# Altium project BeagleCape.PrjPcb
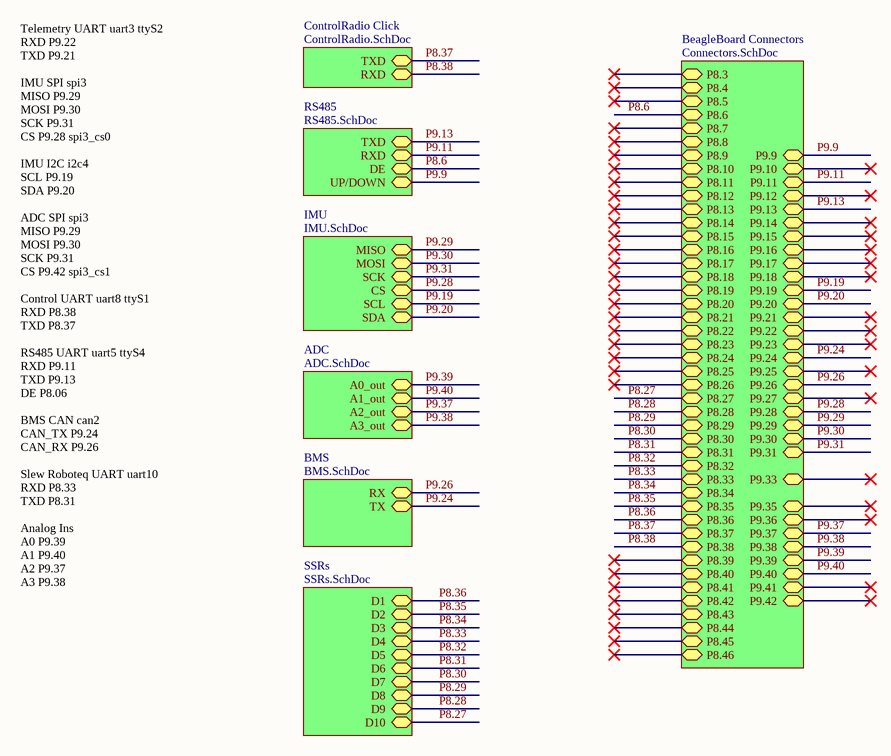
[diagram p0: Main.SchDoc]
9 sheets, 235 parts. Net scope: hierarchical (ports join the sheet entries above them; power ports are global).
Board file: Main.PcbDoc
Sheets:
  Main.SchDoc
    RS485 = RS485.SchDoc
    IMU = IMU.SchDoc
    ADC = ADC.SchDoc
    BeagleBoard Connectors = Connectors.SchDoc
    ControlRadio Click = ControlRadio.SchDoc
    BMS = BMS.SchDoc
    SSRs = SSRs.SchDoc
      FET10 = FET.SchDoc
      FET9 = FET.SchDoc
      FET8 = FET.SchDoc
      FET7 = FET.SchDoc
      FET6 = FET.SchDoc
      FET5 = FET.SchDoc
      FET4 = FET.SchDoc
      FET3 = FET.SchDoc
      FET2 = FET.SchDoc
      FET1 = FET.SchDoc

## Sheet Main.SchDoc
size A

### Sub-sheets
ADC = ADC.SchDoc: A2_out, A3_out, A0_out, A1_out
BeagleBoard Connectors = Connectors.SchDoc: P9.42, P9.17, P8.18, P9.21, P8.32, P9.33, P9.23, P8.28, P9.19, P9.16, P9.12, P9.31, P8.26, P9.15, P8.41, P9.36, P8.46, P8.36, P9.14, P8.12, P9.13, P9.20, P9.11, P8.20, P9.40, P8.24, P9.28, P9.30, P9.24, P9.22, P9.18, P8.22, P8.16, P8.44, P9.38, P8.38, P8.34, P9.26, P8.43, P9.25, P8.42, P9.41, P9.35, P9.27, P9.37, P9.39, P8.10, P8.30, P8.14, P8.45, P8.6, P9.29, P9.10, P8.4, P9.9, P8.8, P8.40, P8.5, P8.27, P8.3, P8.21, P8.7, P8.39, P8.19, P8.17, P8.15, P8.13, P8.35, P8.33, P8.37, P8.23, P8.9, P8.11, P8.25, P8.31, P8.29
BMS = BMS.SchDoc: RX, TX
ControlRadio Click = ControlRadio.SchDoc: TXD, RXD
IMU = IMU.SchDoc: MISO, MOSI, SCK, CS, SCL, SDA
RS485 = RS485.SchDoc: TXD, RXD, DE, UP/DOWN
SSRs = SSRs.SchDoc: D1, D2, D3, D4, D5, D6, D7, D8, D9, D10

### Nets
P8.6: sheet RS485/DE, sheet BeagleBoard Connectors/P8.6
P8.27: sheet BeagleBoard Connectors/P8.27, sheet SSRs/D10
P8.28: sheet BeagleBoard Connectors/P8.28, sheet SSRs/D9
P8.29: sheet BeagleBoard Connectors/P8.29, sheet SSRs/D8
P8.30: sheet BeagleBoard Connectors/P8.30, sheet SSRs/D7
P8.31: sheet BeagleBoard Connectors/P8.31, sheet SSRs/D6
P8.32: sheet BeagleBoard Connectors/P8.32, sheet SSRs/D5
P8.33: sheet BeagleBoard Connectors/P8.33, sheet SSRs/D4
P8.34: sheet BeagleBoard Connectors/P8.34, sheet SSRs/D3
P8.35: sheet BeagleBoard Connectors/P8.35, sheet SSRs/D2
P8.36: sheet BeagleBoard Connectors/P8.36, sheet SSRs/D1
P8.37: sheet BeagleBoard Connectors/P8.37, sheet ControlRadio Click/TXD
P8.38: sheet BeagleBoard Connectors/P8.38, sheet ControlRadio Click/RXD
P9.9: sheet RS485/UP/DOWN, sheet BeagleBoard Connectors/P9.9
P9.11: sheet RS485/RXD, sheet BeagleBoard Connectors/P9.11
P9.13: sheet RS485/TXD, sheet BeagleBoard Connectors/P9.13
P9.19: sheet IMU/SCL, sheet BeagleBoard Connectors/P9.19
P9.20: sheet IMU/SDA, sheet BeagleBoard Connectors/P9.20
P9.24: sheet BeagleBoard Connectors/P9.24, sheet BMS/TX
P9.26: sheet BeagleBoard Connectors/P9.26, sheet BMS/RX
P9.28: sheet IMU/CS, sheet BeagleBoard Connectors/P9.28
P9.29: sheet IMU/MISO, sheet BeagleBoard Connectors/P9.29
P9.30: sheet IMU/MOSI, sheet BeagleBoard Connectors/P9.30
P9.31: sheet IMU/SCK, sheet BeagleBoard Connectors/P9.31
P9.37: sheet ADC/A2_out, sheet BeagleBoard Connectors/P9.37  [project net A2_18]
P9.38: sheet ADC/A3_out, sheet BeagleBoard Connectors/P9.38  [project net A3_18]
P9.39: sheet ADC/A0_out, sheet BeagleBoard Connectors/P9.39  [project net A0_18]
P9.40: sheet ADC/A1_out, sheet BeagleBoard Connectors/P9.40  [project net A1_18]

### Notes on the sheet
- Telemetry UART uart3 ttyS2
  RXD P9.22
  TXD P9.21
  IMU SPI spi3
  MISO P9.29
  MOSI P9.30
  SCK P9.31
  CS P9.28 spi3_cs0
  IMU I2C i2c4
  SCL P9.19
  SDA P9.20
  ADC SPI spi3
  MISO P9.29
  MOSI P9.30
  SCK P9.31
  CS P9.42 spi3_cs1
  Control UART uart8 ttyS1
  RXD P8.38
  TXD P8.37
  RS485 UART uart5 ttyS4
  RXD P9.11
  TXD P9.13
  DE P8.06
  BMS CAN can2
  CAN_TX P9.24
  CAN_RX P9.26
  Slew Roboteq UART uart10
  RXD P8.33
  TXD P8.31
  Analog Ins
  A0 P9.39
  A1 P9.40
  A2 P9.37
  A3 P9.38

## Sheet RS485.SchDoc
size A
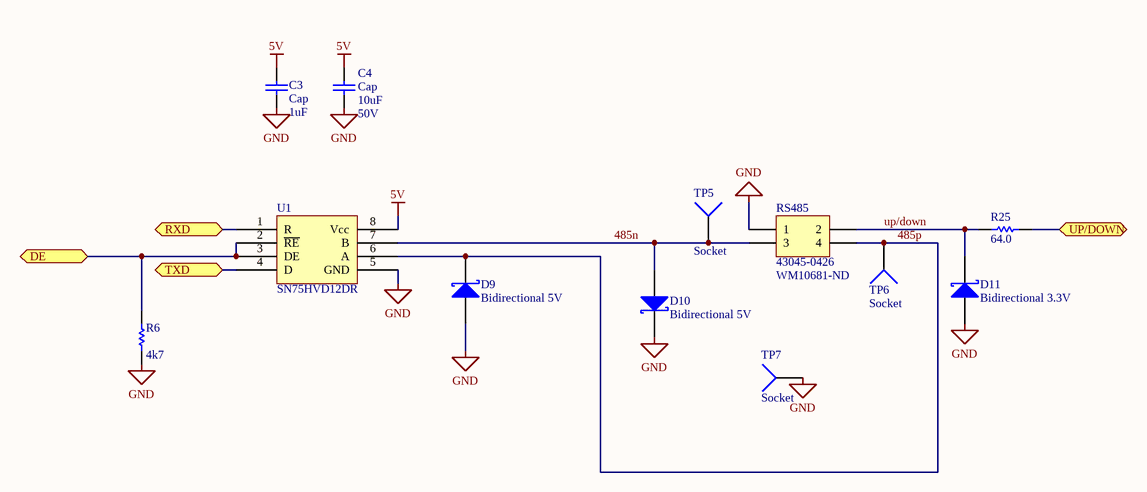
[diagram p1: RS485.SchDoc]

### Parts
C3  Cap  value 1uF  [RESC3116X65N]
C4  Cap  value 10uF  Voltage Rating: 50V  [CAPC3216X180N]
D9  Bidirectional 5V  [THRMC0603X33N]
D10  Bidirectional 5V  [THRMC0603X33N]
D11  Bidirectional 3.3V  [THRMC0603X33N]
R6  value 4k7  [0402]  (hidden comment: Res1)
R25  value 64.0  [0402]  (hidden comment: Res1)
RS485  43045-0426  Vendor Part Number: WM10681-ND  [43045-0426]
TP5  Socket  [5006]
TP6  Socket  [5006]
TP7  Socket  [5006]
U1  SN75HVD12DR  [SOIC127P599X175-8N]

### Ports
DE, RXD, TXD, UP/DOWN

### Nets
5V: C3.2 C4.2 U1.8(Vcc)
GND: C3.1 C4.1 D9.3(A) D10.1(K) D11.3(A) R6.2 RS485.1 TP7.1 U1.5(GND)
485n: D10.3(A) RS485.3 TP5.1 U1.7(B)
485p: D9.1(K) RS485.4 TP6.1 U1.6(A)
P8.6: R6.1 U1.2(~{RE}) U1.3(DE) ; port DE
P9.9: R25.1 ; port UP/DOWN
P9.11: U1.1(R) ; port RXD
P9.13: U1.4(D) ; port TXD
up/down: D11.1(K) R25.2 RS485.2

### Library data of the parts
C3 = Cap: Capacitor; Manufacturer Part Number: CL31B105KCHNNNE; Vendor Part Number: 1276-1838-1-ND
C4 = Cap: Capacitor; Manufacturer Part Number: CL31A106MBHNNNE; Vendor Part Number: 1276-6736-1-ND
D9 D10 = Diode 10TQ040: TVS; Manufacturer Part Number: CPDUC5V0R-HF; Vendor Part Number: 641-1764-1-ND
D11 = Diode 10TQ040: TVS; Manufacturer Part Number: SP1103C-01UTG; Vendor Part Number: F10154CT-ND
R6 = Res1: Resistor; Manufacturer Part Number: RC0402FR-074K7L; Vendor Part Number: 311-4.7KLRCT-ND; Tolerance: 1%
R25 = Res1: Resistor; Manufacturer Part Number: RC0402FR-0760R4L; Vendor Part Number: 311-60.4LRCT-ND; Tolerance: 1%; DNP: *
RS485 = Header 2X2: Header, 2-Pin, Dual row; LatestRevisionDate: 17-Jul-2002; LatestRevisionNote: Re-released for DXP Platform.; Publisher: Altium Limited
TP5-TP7 = Socket: Vendor Part Number: 36-5006-ND; LatestRevisionDate: 17-Jul-2002; LatestRevisionNote: Re-released for DXP Platform.; Publisher: Altium Limited; Manufacturer Part Number: 5006
U1 = SN75HVD12DR: Manufacturer Part Number: THVD1450DR; Vendor Part Number: 296-50395-1-ND; Vendor: Digikey

## Sheet IMU.SchDoc
size A
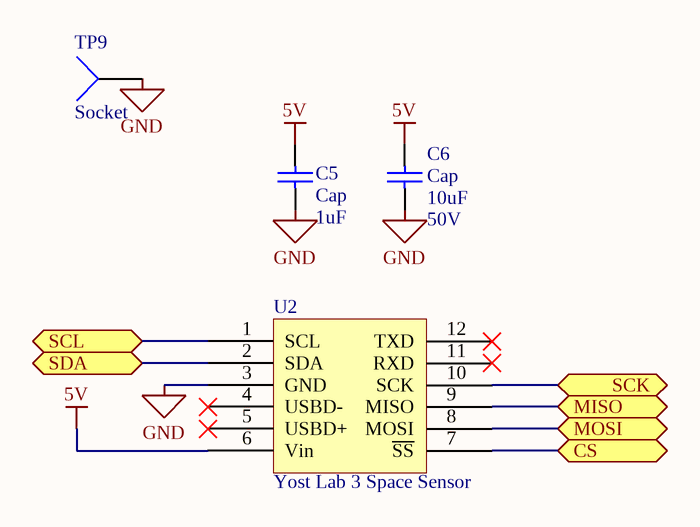
[diagram p2: IMU.SchDoc]

### Parts
C5  Cap  value 1uF  [RESC3116X65N]
C6  Cap  value 10uF  Voltage Rating: 50V  [CAPC3216X180N]
TP9  Socket  [5006]
U2  Yost Lab 3 Space Sensor  [Yost 3 Space Sensor]

### Ports
CS, MISO, MOSI, SCK, SCL, SDA

### Nets
5V: C5.2 C6.2 U2.6(Vin)
GND: C5.1 C6.1 TP9.1 U2.3(GND)
P9.19: U2.1(SCL) ; port SCL
P9.20: U2.2(SDA) ; port SDA
P9.28: U2.7(~{SS}) ; port CS
P9.29: U2.9(MISO) ; port MISO
P9.30: U2.8(MOSI) ; port MOSI
P9.31: U2.10(SCK) ; port SCK

Not connected (* = marked no-connect by the designer): U2 4(USBD-)* 5(USBD+)* 11(RXD)* 12(TXD)*

### Library data of the parts
C5 = Cap: as C3 on sheet RS485
C6 = Cap: as C4 on sheet RS485
TP9 = Socket: Vendor Part Number: 36-5006-ND; LatestRevisionDate: 17-Jul-2002; LatestRevisionNote: Re-released for DXP Platform.; Publisher: Altium Limited; Manufacturer Part Number: 5006
U2 = Yost Lab 3 Space Sensor: Manufacturer Part Number: Yost Lab 3 Space Sensor; Vendor Part Number: Yost Lab 3 Space Sensor

## Sheet ADC.SchDoc
size A
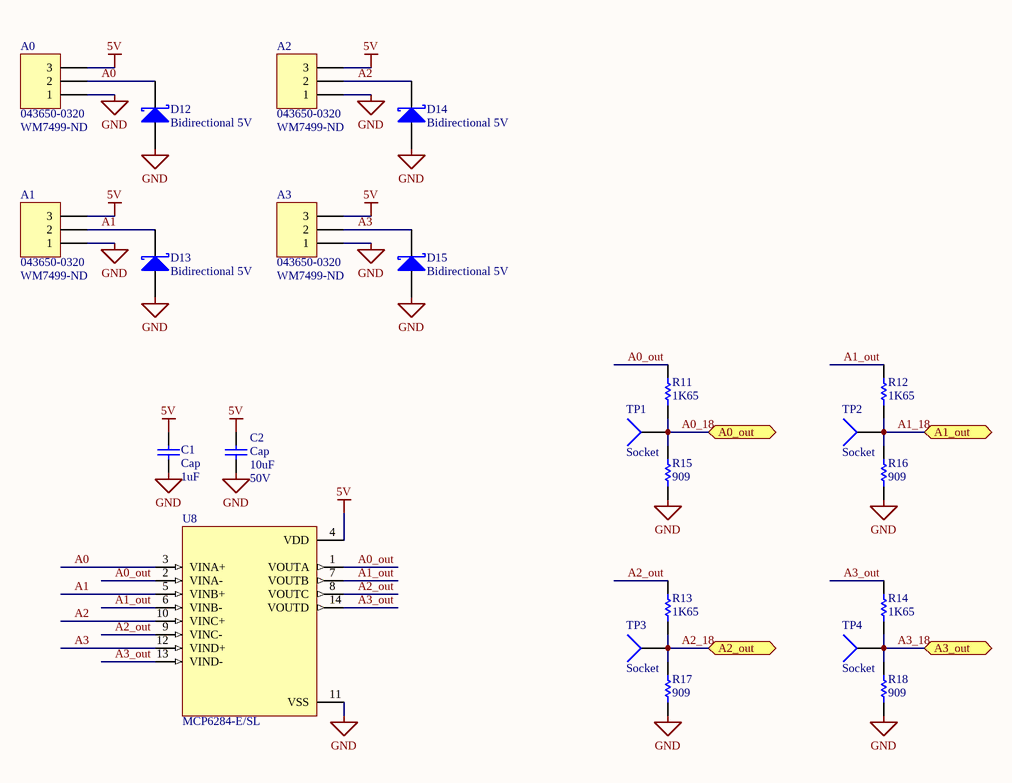
[diagram p3: ADC.SchDoc]

### Parts
A0  043650-0320  Vendor Part Number: WM7499-ND  [43650-0320]
A1  043650-0320  Vendor Part Number: WM7499-ND  [43650-0320]
A2  043650-0320  Vendor Part Number: WM7499-ND  [43650-0320]
A3  043650-0320  Vendor Part Number: WM7499-ND  [43650-0320]
C1  Cap  value 1uF  [RESC3116X65N]
C2  Cap  value 10uF  Voltage Rating: 50V  [CAPC3216X180N]
D12  Bidirectional 5V  [THRMC0603X33N]
D13  Bidirectional 5V  [THRMC0603X33N]
D14  Bidirectional 5V  [THRMC0603X33N]
D15  Bidirectional 5V  [THRMC0603X33N]
R11  value 1K65  [0402]  (hidden comment: Res1)
R12  value 1K65  [0402]  (hidden comment: Res1)
R13  value 1K65  [0402]  (hidden comment: Res1)
R14  value 1K65  [0402]  (hidden comment: Res1)
R15  value 909  [0402]  (hidden comment: Res1)
R16  value 909  [0402]  (hidden comment: Res1)
R17  value 909  [0402]  (hidden comment: Res1)
R18  value 909  [0402]  (hidden comment: Res1)
TP1  Socket  [5006]
TP2  Socket  [5006]
TP3  Socket  [5006]
TP4  Socket  [5006]
U8  MCP6284-E/SL  [SOIC127P600X175-14N]

### Ports
A0_out, A1_out, A2_out, A3_out

### Nets
5V: A0.3 A1.3 A2.3 A3.3 C1.2 C2.2 U8.4(VDD)
GND: A0.1 A1.1 A2.1 A3.1 C1.1 C2.1 D12.3(A) D13.3(A) D14.3(A) D15.3(A) R15.1 R16.1 R17.1 R18.1 U8.11(VSS)
A0: A0.2 D12.1(K) U8.3(VINA+)
A0_18: R11.1 R15.2 TP1.1 ; port A0_out
A0_out: R11.2 U8.1(VOUTA) U8.2(VINA-)
A1: A1.2 D13.1(K) U8.5(VINB+)
A1_18: R12.1 R16.2 TP2.1 ; port A1_out
A1_out: R12.2 U8.6(VINB-) U8.7(VOUTB)
A2: A2.2 D14.1(K) U8.10(VINC+)
A2_18: R13.1 R17.2 TP3.1 ; port A2_out
A2_out: R13.2 U8.8(VOUTC) U8.9(VINC-)
A3: A3.2 D15.1(K) U8.12(VIND+)
A3_18: R14.1 R18.2 TP4.1 ; port A3_out
A3_out: R14.2 U8.13(VIND-) U8.14(VOUTD)

### Library data of the parts
A0-A3 = Header 3: Header, 3-Pin; LatestRevisionDate: 17-Jul-2002; LatestRevisionNote: Re-released for DXP Platform.; Publisher: Altium Limited
C1 = Cap: as C3 on sheet RS485
C2 = Cap: as C4 on sheet RS485
D12-D15 = Diode 10TQ040: as D9 on sheet RS485
R11 = Res1: Resistor; Manufacturer Part Number: YAG3043CT-ND; Vendor Part Number: RC0402FR-071K65L; Tolerance: 1%
R12-R14 = Res1: Resistor; Manufacturer Part Number: RC0402FR-071K65L; Vendor Part Number: YAG3043CT-ND; Tolerance: 1%
R15-R18 = Res1: Resistor; Manufacturer Part Number: RC0402FR-071K8L; Vendor Part Number: YAG3256CT-ND; Tolerance: 1%
TP1-TP4 = Socket: Vendor Part Number: 36-5006-ND; LatestRevisionDate: 17-Jul-2002; LatestRevisionNote: Re-released for DXP Platform.; Publisher: Altium Limited; Manufacturer Part Number: 5006
U8 = MCP6284-E/SL: General Purpose Amplifier 4 Circuit Rail-to-Rail 14-SOIC; Vendor Part Number: MCP6284-E/SL-ND; MF: Microchip; Value: *; SnapEDA_Link: https://www.snapeda.com/parts/MCP6284-E/SL/Microchip/view-part/282490/?ref=snap; MP: MCP6284-E/SL; Availability: Warning; Mouser-Purchase-URL: https://snapeda.com/shop?store=Mouser&id=282490; Price: None; DigiKey-Purchase-URL: https://snapeda.com/shop?store=DigiKey&id=282490; Package: SOIC-14 Microchip; Manufacturer Part Number: MCP6284-E/SL

## Sheet Connectors.SchDoc
size A
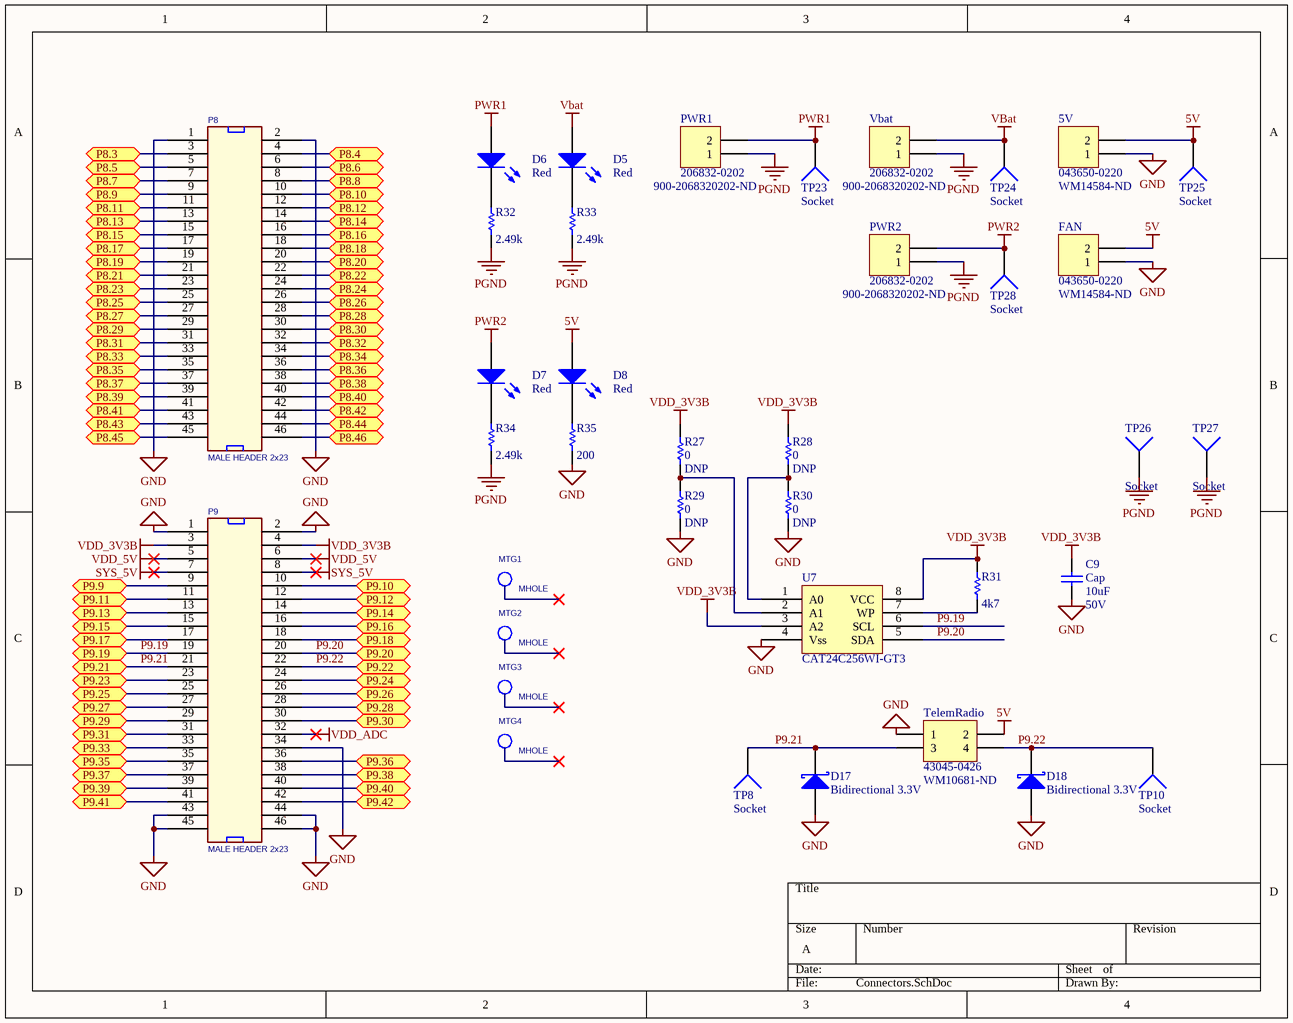
[diagram p4: Connectors.SchDoc]

### Parts
5V  043650-0220  Vendor Part Number: WM14584-ND  [43650-0220]
C9  Cap  value 10uF  Voltage Rating: 50V  [CAPC3216X180N]
D5  Color: Red  [THRMC0603X33N]  (hidden comment: LED0)
D6  Color: Red  [THRMC0603X33N]  (hidden comment: LED0)
D7  Color: Red  [THRMC0603X33N]  (hidden comment: LED0)
D8  Color: Red  [THRMC0603X33N]  (hidden comment: LED0)
D17  Bidirectional 3.3V  [THRMC0603X33N]
D18  Bidirectional 3.3V  [THRMC0603X33N]
FAN  043650-0220  Vendor Part Number: WM14584-ND  [43650-0220]
MTG1  MHOLE  [MTGH200C125D_PL]  (no BOM)
MTG2  MHOLE  [MTGH200C125D_PL]  (no BOM)
MTG3  MHOLE  [MTGH200C125D_PL]  (no BOM)
MTG4  MHOLE  [MTGH200C125D_PL]  (no BOM)
P8  MALE HEADER 2x23  [95278-101B46LF]
P9  MALE HEADER 2x23  [95278-101B46LF]
PWR1  206832-0202  Vendor Part Number: 900-2068320202-ND  [206832-0202]
PWR2  206832-0202  Vendor Part Number: 900-2068320202-ND  [206832-0202]
R27  value 0  [0402]  (hidden comment: Res1)
R28  value 0  [0402]  (hidden comment: Res1)
R29  value 0  [0402]  (hidden comment: Res1)
R30  value 0  [0402]  (hidden comment: Res1)
R31  value 4k7  [0402]  (hidden comment: Res1)
R32  value 2.49k  [0402]  (hidden comment: Res1)
R33  value 2.49k  [0402]  (hidden comment: Res1)
R34  value 2.49k  [0402]  (hidden comment: Res1)
R35  value 200  [0402]  (hidden comment: Res1)
TelemRadio  43045-0426  Vendor Part Number: WM10681-ND  [43045-0426]
TP8  Socket  [5006]
TP10  Socket  [5006]
TP23  Socket  [5006]
TP24  Socket  [5006]
TP25  Socket  [5006]
TP26  Socket  [5006]
TP27  Socket  [5006]
TP28  Socket  [5006]
U7  CAT24C256WI-GT3  [SOIC127P599X175-8N]
Vbat  206832-0202  Vendor Part Number: 900-2068320202-ND  [206832-0202]

### Ports
P8.3, P8.4, P8.5, P8.6, P8.7, P8.8, P8.9, P8.10, P8.11, P8.12, P8.13, P8.14, P8.15, P8.16, P8.17, P8.18, P8.19, P8.20, P8.21, P8.22, P8.23, P8.24, P8.25, P8.26, P8.27, P8.28, P8.29, P8.30, P8.31, P8.32, P8.33, P8.34, P8.35, P8.36, P8.37, P8.38, P8.39, P8.40, P8.41, P8.42, P8.43, P8.44, P8.45, P8.46, P9.9, P9.10, P9.11, P9.12, P9.13, P9.14, P9.15, P9.16, P9.17, P9.18, P9.19, P9.20, P9.21, P9.22, P9.23, P9.24, P9.25, P9.26, P9.27, P9.28, P9.29, P9.30, P9.31, P9.33, P9.35, P9.36, P9.37, P9.38, P9.39, P9.40, P9.41, P9.42

### Nets
5V: 5V.2 D8.1(A) FAN.2 TelemRadio.2 TP25.1
GND: 5V.1 C9.1 D17.3(A) D18.3(A) FAN.1 P8.1 P8.2 P9.1 P9.2 P9.34 P9.43 P9.44 P9.45 P9.46 R29.1 R30.1 R35.2 TelemRadio.1 U7.4(Vss)
PGND: PWR1.1 PWR2.1 R32.2 R33.2 R34.2 TP26.1 TP27.1 Vbat.1
PWR1: D6.1(A) PWR1.2 TP23.1
PWR2: D7.1(A) PWR2.2 TP28.1
SYS_5V: P9.7 P9.8
VBat: D5.1(A) TP24.1 Vbat.2
VDD_3V3B: C9.2 P9.3 P9.4 R27.2 R28.2 R31.1 U7.3(A2) U7.8(VCC)
VDD_5V: P9.5 P9.6
VDD_ADC: P9.32
A0_18: P9.39 ; port P9.39
A1_18: P9.40 ; port P9.40
A2_18: P9.37 ; port P9.37
A3_18: P9.38 ; port P9.38
P8.6: P8.6 ; port P8.6
P8.27: P8.27 ; port P8.27
P8.28: P8.28 ; port P8.28
P8.29: P8.29 ; port P8.29
P8.30: P8.30 ; port P8.30
P8.31: P8.31 ; port P8.31
P8.32: P8.32 ; port P8.32
P8.33: P8.33 ; port P8.33
P8.34: P8.34 ; port P8.34
P8.35: P8.35 ; port P8.35
P8.36: P8.36 ; port P8.36
P8.37: P8.37 ; port P8.37
P8.38: P8.38 ; port P8.38
P9.9: P9.9 ; port P9.9
P9.11: P9.11 ; port P9.11
P9.13: P9.13 ; port P9.13
P9.19: P9.19 U7.6(SCL) ; port P9.19
P9.20: P9.20 U7.5(SDA) ; port P9.20
P9.21: D17.1(K) P9.21 TelemRadio.3 TP8.1 ; port P9.21
P9.22: D18.1(K) P9.22 TelemRadio.4 TP10.1 ; port P9.22
P9.24: P9.24 ; port P9.24
P9.26: P9.26 ; port P9.26
P9.28: P9.28 ; port P9.28
P9.29: P9.29 ; port P9.29
P9.30: P9.30 ; port P9.30
P9.31: P9.31 ; port P9.31
NetD5_3: D5.3(K) R33.1
NetD6_3: D6.3(K) R32.1
NetD7_3: D7.3(K) R34.1
NetD8_3: D8.3(K) R35.1
NetP8_3: P8.3 ; port P8.3
NetP8_4: P8.4 ; port P8.4
NetP8_5: P8.5 ; port P8.5
NetP8_7: P8.7 ; port P8.7
NetP8_8: P8.8 ; port P8.8
NetP8_9: P8.9 ; port P8.9
NetP8_10: P8.10 ; port P8.10
NetP8_11: P8.11 ; port P8.11
NetP8_12: P8.12 ; port P8.12
NetP8_13: P8.13 ; port P8.13
NetP8_14: P8.14 ; port P8.14
NetP8_15: P8.15 ; port P8.15
NetP8_16: P8.16 ; port P8.16
NetP8_17: P8.17 ; port P8.17
NetP8_18: P8.18 ; port P8.18
NetP8_19: P8.19 ; port P8.19
NetP8_20: P8.20 ; port P8.20
NetP8_21: P8.21 ; port P8.21
NetP8_22: P8.22 ; port P8.22
NetP8_23: P8.23 ; port P8.23
NetP8_24: P8.24 ; port P8.24
NetP8_25: P8.25 ; port P8.25
NetP8_26: P8.26 ; port P8.26
NetP8_39: P8.39 ; port P8.39
NetP8_40: P8.40 ; port P8.40
NetP8_41: P8.41 ; port P8.41
NetP8_42: P8.42 ; port P8.42
NetP8_43: P8.43 ; port P8.43
NetP8_44: P8.44 ; port P8.44
NetP8_45: P8.45 ; port P8.45
NetP8_46: P8.46 ; port P8.46
NetP9_10: P9.10 ; port P9.10
NetP9_12: P9.12 ; port P9.12
NetP9_14: P9.14 ; port P9.14
NetP9_15: P9.15 ; port P9.15
NetP9_16: P9.16 ; port P9.16
NetP9_17: P9.17 ; port P9.17
NetP9_18: P9.18 ; port P9.18
NetP9_23: P9.23 ; port P9.23
NetP9_25: P9.25 ; port P9.25
NetP9_27: P9.27 ; port P9.27
NetP9_33: P9.33 ; port P9.33
NetP9_35: P9.35 ; port P9.35
NetP9_36: P9.36 ; port P9.36
NetP9_41: P9.41 ; port P9.41
NetP9_42: P9.42 ; port P9.42
NetR27_1: R27.1 R29.2 U7.2(A1)
NetR28_1: R28.1 R30.2 U7.1(A0)
NetR31_2: R31.2 U7.7(WP)

Not connected (* = marked no-connect by the designer): MTG1 1(TP)*; MTG2 1(TP)*; MTG3 1(TP)*; MTG4 1(TP)*

### Library data of the parts
5V FAN PWR1 PWR2 Vbat = Header 2: Header, 2-Pin; LatestRevisionDate: 17-Jul-2002; LatestRevisionNote: Re-released for DXP Platform.; Publisher: Altium Limited
  PWR1 PWR2 Vbat: Manufacturer Part Number: 206832-0202
C9 = Cap: as C4 on sheet RS485
D5-D8 = LED0: Typical INFRARED GaAs LED; Vendor Part Number: 732-11991-1-ND; Manufacturer Part Number: 150040RS73240; Vf: 2V; I: 20mA
D17 D18 = Diode 10TQ040: as D11 on sheet RS485
P8 = HDR_46_F_2_0.1_0.1: CONN HEADER FMAL 46PS.1" DL GOLD; Manufacturer: Sullins Connector Solutions; Manufacturer Part Number: S7126-ND; Vendor Part Number: 95278-101-46LF; Vendor Part Number: 95278-101B46LF-ND; Number of Positions: 46; Number of Positions Loaded: All; Pitch: 0.100" (2.54mm); Supplier 1: Digi-Key; Supplier Part Number 1: S7126-ND; RoHS: RoHS Compliant; Category: Connectors, Interconnects; Stock 1: 750; Pricing 1: 1=2.75, 10=2.325, 25=2.2196, 50=2.0084, 100=1.7969, 250=1.58552, 500=1.4798, 1000=1.3741, 2500=1.32125 (USD); Connector Type: Header; Contact Type: Female Socket; Number of Rows: 2; Row Spacing: 0.100" (2.54mm); Mounting Type: Through Hole; Termination: Solder; Fastening Type: -; Features: -; Contact Finish: Gold; Contact Finish Thickness: Flash; Color: Black; Packaging: Bulk; ComponentLink1URL: http://www.sullinscorp.com/drawings/78_P(N)PxCxxxLFBN-RC,_10492-G.pdf; ComponentLink1Description: http://www.sullinscorp.com/drawings/78_P(N)PxCxxxLFBN-RC,_10492-G.pdf
P9 = HDR_46_F_2_0.1_0.1: CONN HEADER FMAL 46PS.1" DL GOLD; Manufacturer: Sullins Connector Solutions; Vendor Part Number: 95278-101-46LF; Vendor Part Number: 95278-101B46LF-ND; Number of Positions: 46; Number of Positions Loaded: All; Pitch: 0.100" (2.54mm); Supplier 1: Digi-Key; Supplier Part Number 1: S7126-ND; RoHS: RoHS Compliant; Category: Connectors, Interconnects; Stock 1: 750; Pricing 1: 1=2.75, 10=2.325, 25=2.2196, 50=2.0084, 100=1.7969, 250=1.58552, 500=1.4798, 1000=1.3741, 2500=1.32125 (USD); Connector Type: Header; Contact Type: Female Socket; Number of Rows: 2; Row Spacing: 0.100" (2.54mm); Mounting Type: Through Hole; Termination: Solder; Fastening Type: -; Features: -; Contact Finish: Gold; Contact Finish Thickness: Flash; Color: Black; Packaging: Bulk; ComponentLink1URL: http://www.sullinscorp.com/drawings/78_P(N)PxCxxxLFBN-RC,_10492-G.pdf; ComponentLink1Description: http://www.sullinscorp.com/drawings/78_P(N)PxCxxxLFBN-RC,_10492-G.pdf
R27-R30 = Res1: Resistor; Manufacturer Part Number: RC0402FR-070RL; Vendor Part Number: 311-0.0LRCT-ND; Tolerance: 1%; DNP: DNP
R31 = Res1: as R6 on sheet RS485
R32-R34 = Res1: Resistor; Manufacturer Part Number: RC0402FR-072K49L; Vendor Part Number: 311-2.49KLRCT-ND; Tolerance: 1%
R35 = Res1: Resistor; Manufacturer Part Number: RC0402FR-07200RL; Vendor Part Number: 311-200LRCT-ND; Tolerance: 1%
TelemRadio = Header 2X2: Header, 2-Pin, Dual row; LatestRevisionDate: 17-Jul-2002; LatestRevisionNote: Re-released for DXP Platform.; Publisher: Altium Limited
TP8 TP10 TP23-TP28 = Socket: Vendor Part Number: 36-5006-ND; LatestRevisionDate: 17-Jul-2002; LatestRevisionNote: Re-released for DXP Platform.; Publisher: Altium Limited; Manufacturer Part Number: 5006
U7 = CAT24C256WI-GT3: Vendor Part Number: CAT24C256WI-GT3OSCT-ND; Vendor: Digikey; Manufacturer Part Number: CAT24C256WI-GT3

## Sheet ControlRadio.SchDoc
size A
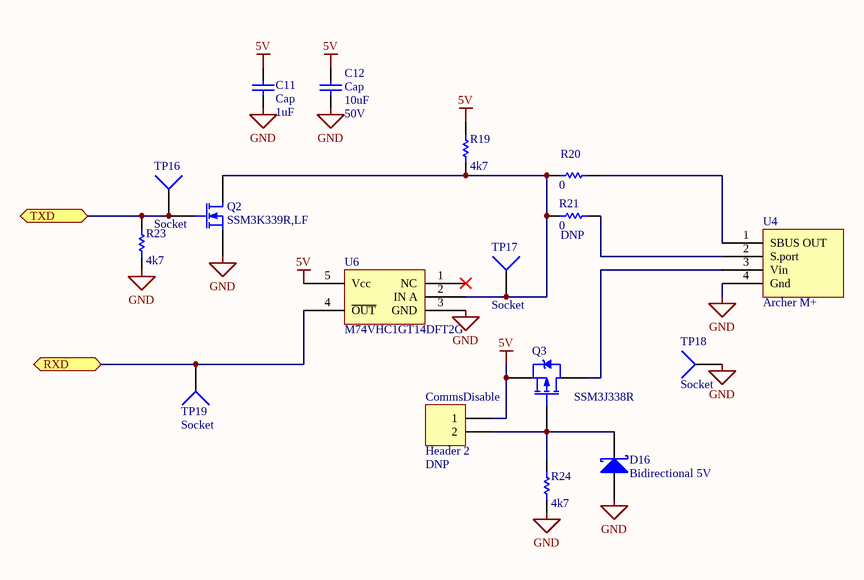
[diagram p5: ControlRadio.SchDoc]

### Parts
C11  Cap  value 1uF  [RESC3116X65N]
C12  Cap  value 10uF  Voltage Rating: 50V  [CAPC3216X180N]
CommsDisable  Header 2  [HDR1X2]
D16  Bidirectional 5V  [THRMC0603X33N]
Q2  SSM3K339R,LF  [SOT95P237X112-3N]
Q3  SSM3J338R  [SOT95P237X112-3N]
R19  value 4k7  [0402]  (hidden comment: Res1)
R20  value 0  [0402]  (hidden comment: Res1)
R21  value 0  [0402]  (hidden comment: Res1)
R23  value 4k7  [0402]  (hidden comment: Res1)
R24  value 4k7  [0402]  (hidden comment: Res1)
TP16  Socket  [5006]
TP17  Socket  [5006]
TP18  Socket  [5006]
TP19  Socket  [5006]
U4  Archer M+  [Archer M+]
U6  M74VHC1GT14DFT2G  [SOT65P210X110-5N]

### Ports
RXD, TXD

### Nets
5V: C11.2 C12.2 CommsDisable.1 Q3.2(S) R19.1 U6.5(Vcc)
GND: C11.1 C12.1 D16.3(A) Q2.2(S) R23.2 R24.2 TP18.1 U4.4(Gnd) U6.3(GND)
P8.37: Q2.1(G) R23.1 TP16.1 ; port TXD
P8.38: TP19.1 U6.4(~{OUT}) ; port RXD
NetCommsDisable_2: CommsDisable.2 D16.1(K) Q3.1(G) R24.1
NetQ2_3: Q2.3(D) R19.2 R20.1 R21.1 TP17.1 U6.2(IN_A)
NetQ3_3: Q3.3(D) U4.3(Vin)
NetR20_2: R20.2 U4.1(SBUS_OUT)
NetR21_2: R21.2 U4.2(S.port)

Not connected (* = marked no-connect by the designer): U6 1(NC)*

### Library data of the parts
C11 = Cap: as C3 on sheet RS485
C12 = Cap: as C4 on sheet RS485
CommsDisable = Header 2: Header, 2-Pin; LatestRevisionDate: 17-Jul-2002; LatestRevisionNote: Re-released for DXP Platform.; Publisher: Altium Limited; DNP: DNP
D16 = Diode 10TQ040: as D9 on sheet RS485
Q2 = MOSFET-N: N-Channel MOSFET; Vendor Part Number: SSM3K339RLFCT-ND; Manufacturer Part Number: SSM3K339R,LF
Q3 = PMOS-2: P-Channel Power MOSFET; Vendor Part Number: SSM3J338RLFCT-ND; Manufacturer Part Number: SSM3J338R
R19 R23 R24 = Res1: as R6 on sheet RS485
R20 R21 = Res1: as R27 on sheet Connectors
  R20: DNP: *
  R21: DNP: DNP
TP16-TP19 = Socket: Vendor Part Number: 36-5006-ND; LatestRevisionDate: 17-Jul-2002; LatestRevisionNote: Re-released for DXP Platform.; Publisher: Altium Limited; Manufacturer Part Number: 5006
U4 = Archer M+: Vendor Part Number: Archer +
U6 = M74VHC1GT14DFT2G: Vendor Part Number: M74VHC1GT14DFT2GOSCT-ND; Manufacturer Part Number: M74VHC1GT14DFT2G

## Sheet BMS.SchDoc
size A
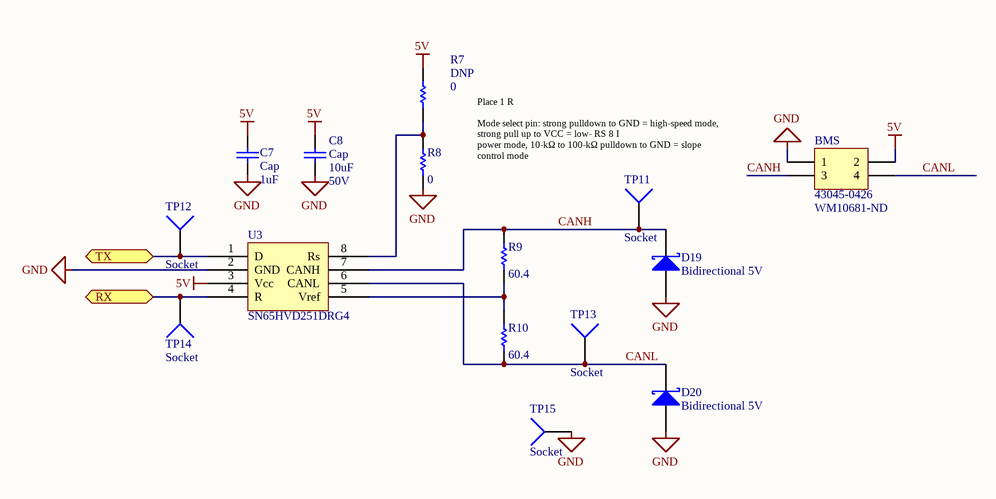
[diagram p6: BMS.SchDoc]

### Parts
BMS  43045-0426  Vendor Part Number: WM10681-ND  [43045-0426]
C7  Cap  value 1uF  [RESC3116X65N]
C8  Cap  value 10uF  Voltage Rating: 50V  [CAPC3216X180N]
D19  Bidirectional 5V  [THRMC0603X33N]
D20  Bidirectional 5V  [THRMC0603X33N]
R7  value 0  [0402]  (hidden comment: Res1)
R8  value 0  [0402]  (hidden comment: Res1)
R9  value 60.4  [0402]  (hidden comment: Res1)
R10  value 60.4  [0402]  (hidden comment: Res1)
TP11  Socket  [5006]
TP12  Socket  [5006]
TP13  Socket  [5006]
TP14  Socket  [5006]
TP15  Socket  [5006]
U3  SN65HVD251DRG4  [SOIC127P599X175-8N]

### Ports
RX, TX

### Nets
5V: BMS.2 C7.2 C8.2 R7.1 U3.3(Vcc)
GND: BMS.1 C7.1 C8.1 D19.3(A) D20.3(A) R8.2 TP15.1 U3.2(GND)
CANH: BMS.3 D19.1(K) R9.1 TP11.1 U3.7(CANH)
CANL: BMS.4 D20.1(K) R10.2 TP13.1 U3.6(CANL)
P9.24: TP12.1 U3.1(D) ; port TX
P9.26: TP14.1 U3.4(R) ; port RX
NetR7_2: R7.2 R8.1 U3.8(Rs)
NetR9_2: R9.2 R10.1 U3.5(Vref)

### Notes on the sheet
- Place 1 R
  Mode select pin: strong pulldown to GND = high-speed mode, strong pull up to VCC = low- RS 8 I
  power mode, 10-kΩ to 100-kΩ pulldown to GND = slope control mode

### Library data of the parts
BMS = Header 2X2: Header, 2-Pin, Dual row; LatestRevisionDate: 17-Jul-2002; LatestRevisionNote: Re-released for DXP Platform.; Publisher: Altium Limited
C7 = Cap: as C3 on sheet RS485
C8 = Cap: as C4 on sheet RS485
D19 D20 = Diode 10TQ040: as D9 on sheet RS485
R7 R8 = Res1: as R27 on sheet Connectors
  R7: DNP: DNP
R9 R10 = Res1: as R25 on sheet RS485
TP11-TP15 = Socket: Vendor Part Number: 36-5006-ND; LatestRevisionDate: 17-Jul-2002; LatestRevisionNote: Re-released for DXP Platform.; Publisher: Altium Limited; Manufacturer Part Number: 5006
U3 = SN65HVD251DRG4: Vendor Part Number: 296-21805-1-ND; Manufacturer Part Number: SN65HVD251DRG4

## Sheet SSRs.SchDoc
size A
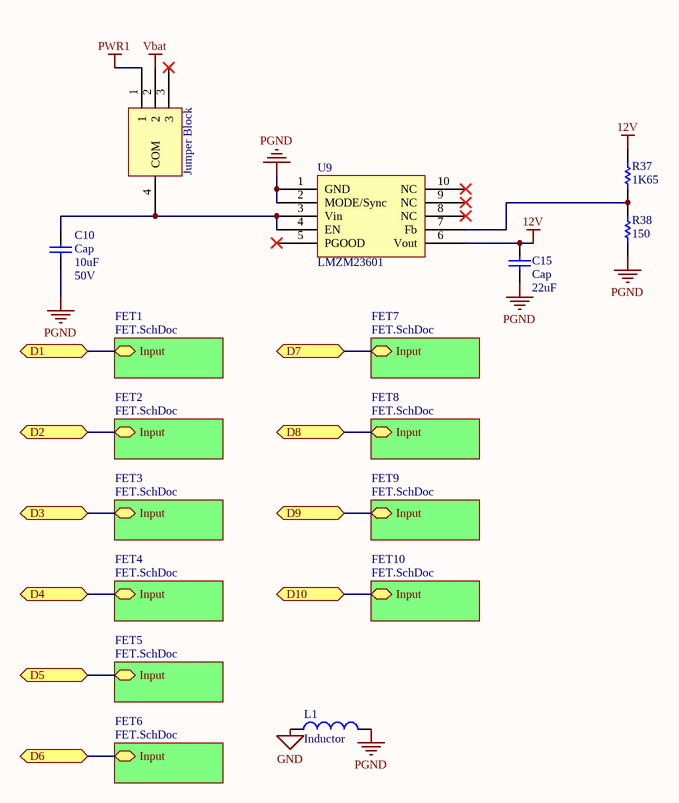
[diagram p7: SSRs.SchDoc]

### Parts
C10  Cap  value 10uF  Voltage Rating: 50V  [CAPC3216X180N]
C15  Cap  value 22uF  [CAPC3216X180N]
J6  Jumper Block  [Jumper Block]
L1  Inductor  [0402-A]
R37  value 1K65  [0402]  (hidden comment: Res1)
R38  value 150  [0402]  (hidden comment: Res1)
U9  LMZM23601  [MODULE_LMZM23600V3SILT]

### Sub-sheets
FET1 = FET.SchDoc: Input
FET2 = FET.SchDoc: Input
FET3 = FET.SchDoc: Input
FET4 = FET.SchDoc: Input
FET5 = FET.SchDoc: Input
FET6 = FET.SchDoc: Input
FET7 = FET.SchDoc: Input
FET8 = FET.SchDoc: Input
FET9 = FET.SchDoc: Input
FET10 = FET.SchDoc: Input

### Ports
D1, D2, D3, D4, D5, D6, D7, D8, D9, D10

### Nets
12V: C15.2 R37.2 U9.6(Vout)
GND: L1.1
PGND: C10.1 C15.1 L1.2 R38.1 U9.1(GND) U9.2(MODE/Sync)
PWR1: J6.1
VBat: J6.2
P8.27: port D10, sheet FET10/Input
P8.28: port D9, sheet FET9/Input
P8.29: port D8, sheet FET8/Input
P8.30: port D7, sheet FET7/Input
P8.31: port D6, sheet FET6/Input
P8.32: port D5, sheet FET5/Input
P8.33: port D4, sheet FET4/Input
P8.34: port D3, sheet FET3/Input
P8.35: port D2, sheet FET2/Input
P8.36: port D1, sheet FET1/Input
NetC10_2: C10.2 J6.4(COM) U9.3(Vin) U9.4(EN)
NetR37_1: R37.1 R38.2 U9.7(Fb)

Not connected (* = marked no-connect by the designer): J6 3*; U9 5(PGOOD)* 8(NC)* 9(NC)* 10(NC)*

### Library data of the parts
C10 = Cap: as C4 on sheet RS485
C15 = Cap: Capacitor; Manufacturer Part Number: CL31A226KAHNNNE; Vendor Part Number: 1276-3047-1-ND
L1 = Inductor: Manufacturer Part Number: MPZ1005S300CT000; Vendor Part Number: 445-2979-1-ND
R37 = Res1: as R11 on sheet ADC
R38 = Res1: Resistor; Manufacturer Part Number: RC0402FR-07150RL; Vendor Part Number: 311-150LRCT-ND; Tolerance: 1%
U9 = LMZM23601: Manufacturer Part Number: LMZM23601SILT; Vendor Part Number: 296-49460-1-ND

## Sheet FET.SchDoc
size A
Used 10 times, as channels SSRs/FET10, SSRs/FET9, SSRs/FET8, SSRs/FET7, SSRs/FET6, SSRs/FET5, SSRs/FET4, SSRs/FET3, SSRs/FET2, SSRs/FET1. Parts and nets are listed once, with the designators drawn on the sheet.
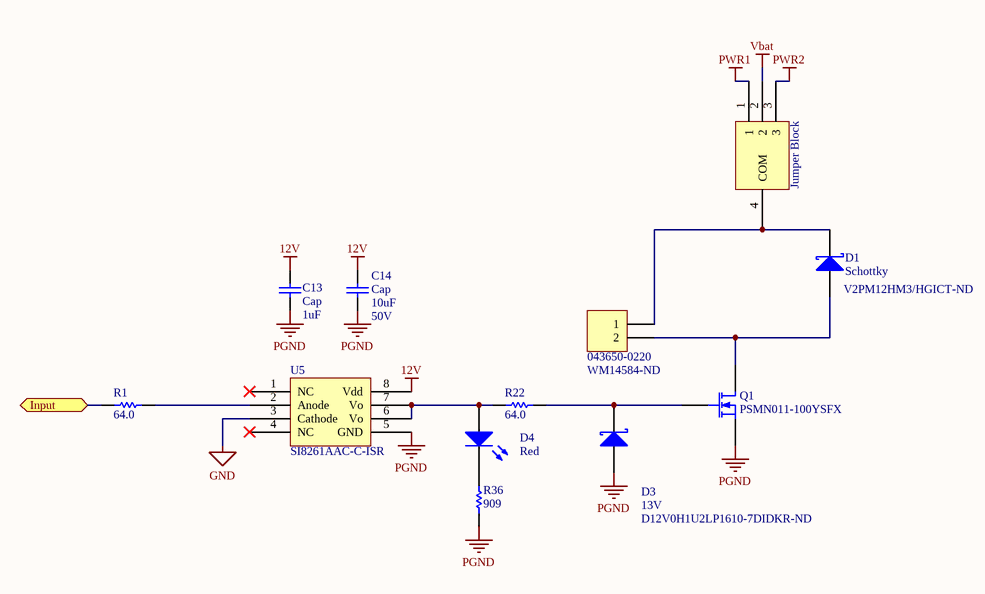
[diagram p8: FET.SchDoc]

### Parts
?  043650-0220  Vendor Part Number: WM14584-ND  [43650-0220]
C13  Cap  value 1uF  [RESC3116X65N]
C14  Cap  value 10uF  Voltage Rating: 50V  [CAPC3216X180N]
D1  Schottky  Vendor Part Number: V2PM12HM3/HGICT-ND  [V2PM12HM3/H]
D3  13V  Vendor Part Number: D12V0H1U2LP1610-7DIDKR-ND  [THRMC0603X33N]
D4  Color: Red  [THRMC0603X33N]  (hidden comment: LED0)
J1_FET1  Jumper Block  [Jumper Block]
Q1  PSMN011-100YSFX  [DPAK127P_600X120-5N]
R1  value 64.0  [0402]  (hidden comment: Res1)
R22  value 64.0  [0402]  (hidden comment: Res1)
R36  value 909  [0402]  (hidden comment: Res1)
U5  SI8261AAC-C-ISR  [SOIC127P599X175-8N]

### Ports
Input

### Nets
12V: C13.2 C14.2 U5.8(Vdd)
GND: U5.3(Cathode)
PGND: C13.1 C14.1 D3.3(A) Q1.3(S) R36.1 U5.5(GND)
PWR1: J1_FET1.1
PWR2: J1_FET1.3
Vbat: J1_FET1.2
Input: R1.1 ; port Input
Net?_1: ?.1 D1.1(K) J1_FET1.4(COM)
Net?_2: ?.2 D1.3(A) Q1.1(D)
NetD3_1: D3.1(K) Q1.2(G) R22.2
NetD4_1: D4.1(A) R22.1 U5.6(Vo) U5.7(Vo)
NetD4_3: D4.3(K) R36.2
NetR1_2: R1.2 U5.2(Anode)

Not connected (* = marked no-connect by the designer): U5 1(NC)* 4(NC)*

### Channels
SSRs/FET10: designators end in _FET10; ports Input=P8.27
SSRs/FET9: designators end in _FET9; ports Input=P8.28
SSRs/FET8: designators end in _FET8; ports Input=P8.29
SSRs/FET7: designators end in _FET7; ports Input=P8.30
SSRs/FET6: designators end in _FET6; ports Input=P8.31
SSRs/FET5: designators end in _FET5; ports Input=P8.32
SSRs/FET4: designators end in _FET4; ports Input=P8.33
SSRs/FET3: designators end in _FET3; ports Input=P8.34
SSRs/FET2: designators end in _FET2; ports Input=P8.35
SSRs/FET1: designators end in _FET1; ports Input=P8.36

### Library data of the parts
? = Header 2: Header, 2-Pin; LatestRevisionDate: 17-Jul-2002; LatestRevisionNote: Re-released for DXP Platform.; Publisher: Altium Limited
C13 = Cap: as C3 on sheet RS485
C14 = Cap: as C4 on sheet RS485
D1 = Diode 10TQ040: TVS; Manufacturer Part Number: V2PM12HM3/H
D3 = Diode 10TQ040: TVS; Manufacturer Part Number: D12V0H1U2LP1610-7
D4 = LED0: as D5 on sheet Connectors
Q1 = MOSFET-N: N-Channel MOSFET; Vendor Part Number: 1727-8475-1-ND; Published: 8-Jun-2000; LatestRevisionDate: 17-Jul-2002; LatestRevisionNote: Re-released for DXP Platform.; PackageVersion: 1995/1996; PackageReference: E3; Publisher: Altium Limited; PackageDescription: TO, Flat Index; 3 In-Line, Axial Leads; Body Dia. 4.6mm; Lead Dia. 0.5 mm (max); Manufacturer Part Number: PSMN011-100YSFX
R1 R22 = Res1: as R25 on sheet RS485
R36 = Res1: as R15 on sheet ADC
U5 = SI8261AAC-C-ISR: Vendor Part Number: 336-4490-1-ND; Vendor: Digikey; Manufacturer Part Number: SI8261AAC-C-ISR

## Nets that join several sheets
5V: RS485 (C3.2 C4.2 U1.8), IMU (C5.2 C6.2 U2.6), ADC (7 pins), Connectors (5 pins), ControlRadio (6 pins), BMS (5 pins)
12V: SSRs (C15.2 R37.2 U9.6), SSRs/FET10 (C13_FET10.2 C14_FET10.2 U5_FET10.8), SSRs/FET9 (C13_FET9.2 C14_FET9.2 U5_FET9.8), SSRs/FET8 (C13_FET8.2 C14_FET8.2 U5_FET8.8), SSRs/FET7 (C13_FET7.2 C14_FET7.2 U5_FET7.8), SSRs/FET6 (C13_FET6.2 C14_FET6.2 U5_FET6.8), SSRs/FET5 (C13_FET5.2 C14_FET5.2 U5_FET5.8), SSRs/FET4 (C13_FET4.2 C14_FET4.2 U5_FET4.8), SSRs/FET3 (C13_FET3.2 C14_FET3.2 U5_FET3.8), SSRs/FET2 (C13_FET2.2 C14_FET2.2 U5_FET2.8), SSRs/FET1 (C13_FET1.2 C14_FET1.2 U5_FET1.8)
GND: RS485 (9 pins), IMU (C5.1 C6.1 TP9.1 U2.3), ADC (15 pins), Connectors (19 pins), ControlRadio (9 pins), BMS (8 pins), SSRs (L1.1), SSRs/FET10 (U5_FET10.3), SSRs/FET9 (U5_FET9.3), SSRs/FET8 (U5_FET8.3), SSRs/FET7 (U5_FET7.3), SSRs/FET6 (U5_FET6.3), SSRs/FET5 (U5_FET5.3), SSRs/FET4 (U5_FET4.3), SSRs/FET3 (U5_FET3.3), SSRs/FET2 (U5_FET2.3), SSRs/FET1 (U5_FET1.3)
PGND: Connectors (8 pins), SSRs (6 pins), SSRs/FET10 (6 pins), SSRs/FET9 (6 pins), SSRs/FET8 (6 pins), SSRs/FET7 (6 pins), SSRs/FET6 (6 pins), SSRs/FET5 (6 pins), SSRs/FET4 (6 pins), SSRs/FET3 (6 pins), SSRs/FET2 (6 pins), SSRs/FET1 (6 pins)
PWR1: Connectors (D6.1 PWR1.2 TP23.1), SSRs (J6.1), SSRs/FET10 (J1_FET1_FET10.1), SSRs/FET9 (J1_FET1_FET9.1), SSRs/FET8 (J1_FET1_FET8.1), SSRs/FET7 (J1_FET1_FET7.1), SSRs/FET6 (J1_FET1_FET6.1), SSRs/FET5 (J1_FET1_FET5.1), SSRs/FET4 (J1_FET1_FET4.1), SSRs/FET3 (J1_FET1_FET3.1), SSRs/FET2 (J1_FET1_FET2.1), SSRs/FET1 (J1_FET1_FET1.1)
PWR2: Connectors (D7.1 PWR2.2 TP28.1), SSRs/FET10 (J1_FET1_FET10.3), SSRs/FET9 (J1_FET1_FET9.3), SSRs/FET8 (J1_FET1_FET8.3), SSRs/FET7 (J1_FET1_FET7.3), SSRs/FET6 (J1_FET1_FET6.3), SSRs/FET5 (J1_FET1_FET5.3), SSRs/FET4 (J1_FET1_FET4.3), SSRs/FET3 (J1_FET1_FET3.3), SSRs/FET2 (J1_FET1_FET2.3), SSRs/FET1 (J1_FET1_FET1.3)
VBat: Connectors (D5.1 TP24.1 Vbat.2), SSRs (J6.2), SSRs/FET10 (J1_FET1_FET10.2), SSRs/FET9 (J1_FET1_FET9.2), SSRs/FET8 (J1_FET1_FET8.2), SSRs/FET7 (J1_FET1_FET7.2), SSRs/FET6 (J1_FET1_FET6.2), SSRs/FET5 (J1_FET1_FET5.2), SSRs/FET4 (J1_FET1_FET4.2), SSRs/FET3 (J1_FET1_FET3.2), SSRs/FET2 (J1_FET1_FET2.2), SSRs/FET1 (J1_FET1_FET1.2)
A0_18: ADC (R11.1 R15.2 TP1.1), Connectors (P9.39)
A1_18: ADC (R12.1 R16.2 TP2.1), Connectors (P9.40)
A2_18: ADC (R13.1 R17.2 TP3.1), Connectors (P9.37)
A3_18: ADC (R14.1 R18.2 TP4.1), Connectors (P9.38)
P8.6: RS485 (R6.1 U1.2 U1.3), Connectors (P8.6)
P8.27: Connectors (P8.27), SSRs/FET10 (R1_FET10.1)
P8.28: Connectors (P8.28), SSRs/FET9 (R1_FET9.1)
P8.29: Connectors (P8.29), SSRs/FET8 (R1_FET8.1)
P8.30: Connectors (P8.30), SSRs/FET7 (R1_FET7.1)
P8.31: Connectors (P8.31), SSRs/FET6 (R1_FET6.1)
P8.32: Connectors (P8.32), SSRs/FET5 (R1_FET5.1)
P8.33: Connectors (P8.33), SSRs/FET4 (R1_FET4.1)
P8.34: Connectors (P8.34), SSRs/FET3 (R1_FET3.1)
P8.35: Connectors (P8.35), SSRs/FET2 (R1_FET2.1)
P8.36: Connectors (P8.36), SSRs/FET1 (R1_FET1.1)
P8.37: Connectors (P8.37), ControlRadio (Q2.1 R23.1 TP16.1)
P8.38: Connectors (P8.38), ControlRadio (TP19.1 U6.4)
P9.9: RS485 (R25.1), Connectors (P9.9)
P9.11: RS485 (U1.1), Connectors (P9.11)
P9.13: RS485 (U1.4), Connectors (P9.13)
P9.19: IMU (U2.1), Connectors (P9.19 U7.6)
P9.20: IMU (U2.2), Connectors (P9.20 U7.5)
P9.24: Connectors (P9.24), BMS (TP12.1 U3.1)
P9.26: Connectors (P9.26), BMS (TP14.1 U3.4)
P9.28: IMU (U2.7), Connectors (P9.28)
P9.29: IMU (U2.9), Connectors (P9.29)
P9.30: IMU (U2.8), Connectors (P9.30)
P9.31: IMU (U2.10), Connectors (P9.31)